# EAGLE design REF-BLE-MINI (EAGLE 7.7.0)

## Sheet 1 of 3
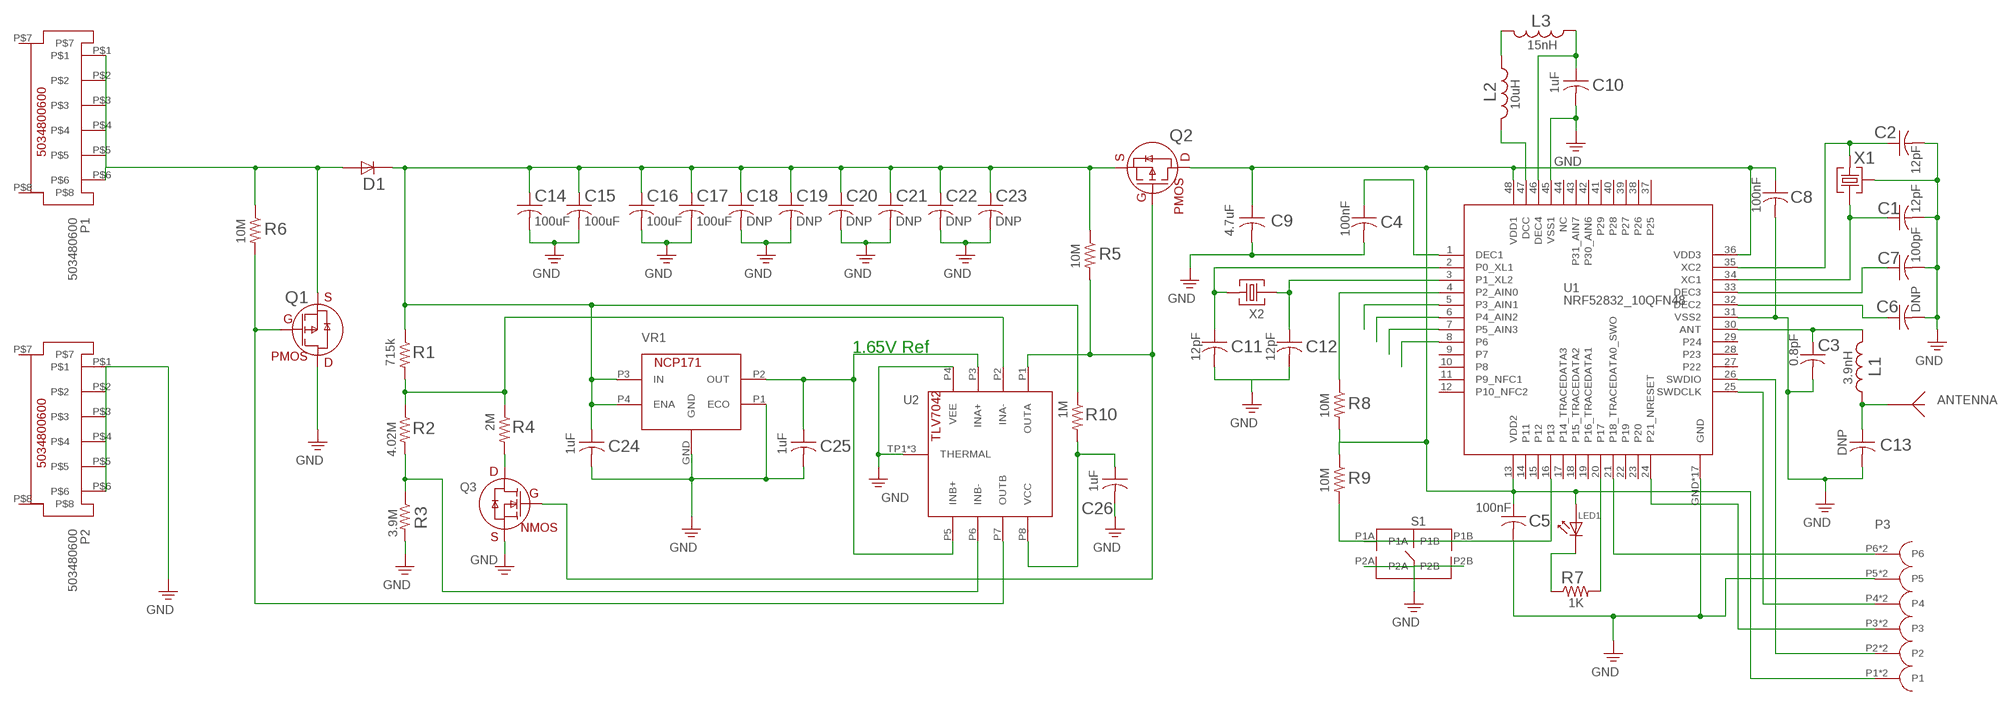
[diagram p0: schematic, sheet 1]

### Parts
ANTENNA  BLE-ANTENNA-NORDIC-2  [BLE-ANTENNA-NORDIC-2]
C1  12pF  C-USC0603  [C0603]
C2  12pF  C-USC0603  [C0603]
C3  0.8pF  C-USC0603  [C0603]
C4  100nF  C-USC0603  [C0603]
C5  100nF  C-USC0603  [C0603]
C6  DNP  C-USC0603  [C0603]
C7  100pF  C-USC0603  [C0603]
C8  100nF  C-USC0603  [C0603]
C9  4.7uF  C-USC0603  [C0603]
C10  1uF  C-USC0603  [C0603]
C11  12pF  C-USC0603  [C0603]
C12  12pF  C-USC0603  [C0603]
C13  DNP  C-USC0603  [C0603]
C14  100uF  C-USC1206  [C1206]
C15  100uF  C-USC1206  [C1206]
C16  100uF  C-USC1206  [C1206]
C17  100uF  C-USC1206  [C1206]
C18  DNP  C-USC1206  [C1206]
C19  DNP  C-USC1206  [C1206]
C20  DNP  C-USC1206  [C1206]
C21  DNP  C-USC1206  [C1206]
C22  DNP  C-USC1206  [C1206]
C23  DNP  C-USC1206  [C1206]
C24  1uF  C-USC0603  [C0603]
C25  1uF  C-USC0603  [C0603]
C26  1uF  C-USC0603  [C0603]
D1  BAT43WS-E3-08  [SOD-323-VISHAY]
L1  3.9nH  L0603  [L0603]
L2  10uH  L0603  [L0603]
L3  15nH  L0603  [L0603]
LED1  LTST-20KGKT  [TST-20KGKT]
P1  503480600  [5034800600]
P2  503480600  [5034800600]
P3  EC-06-CTX  [EC-06-CTX]
Q1  DMG2305U-13  [SOT-23-3-DIODESINC]
Q2  DMG2305U-13  [SOT-23-3-DIODESINC]
Q3  NX138AKR  [SOT-23-3-RENESAS]
R1  715k  R-US_R0603  [R0603]
R2  4.02M  R-US_R0603  [R0603]
R3  3.9M  R-US_R0603  [R0603]
R4  2M  R-US_R0603  [R0603]
R5  10M  R-US_R0603  [R0603]
R6  10M  R-US_R0603  [R0603]
R7  1K  R-US_R0603  [R0603]
R8  10M  R-US_R0603  [R0603]
R9  10M  R-US_R0603  [R0603]
R10  1M  R-US_R0603  [R0603]
S1  EVQ-P7A01P  [EVQ-P7A01P]
U1  NRF52832_10QFN48  [NRF52832_10]
U2  TLV7042DSG  [TLV7042DSG]
VR1  NCP171  [NCP171]
X1  FA-128-32MHZMF10Z-AJ5  [FA-128-EPSON]
X2  FC-135-32.7680KA-AC0  [FC-135-32.7680KA-AC0]

### Nets
GND: C1.2 C2.2 C3.2 C4.2 C5.2 C6.2 C7.2 C8.2 C9.2 C10.2 C11.2 C12.2 C13.2 C14.2 C15.2 C16.2 C17.2 C18.2 C19.2 C20.2 C21.2 C22.2 C23.2 C24.2 C25.2 P2.P$1 P2.P$2 P2.P$3 P2.P$4 P2.P$5 P2.P$6 P3.P5 P3.P11(P5) Q1.3(D) Q3.2(S) R3.2 S1.P2A S1.P2B U1.31(VSS2) U1.45(VSS1) U1.GND U1.P$2(GND) U1.P$3(GND) U1.P$4(GND) U1.P$5(GND) U1.P$6(GND) U1.P$7(GND) U1.P$8(GND) U1.P$9(GND) U1.P$10(GND) U1.P$11(GND) U1.P$12(GND) U1.P$13(GND) U1.P$14(GND) U1.P$15(GND) U1.P$16(GND) U1.P$17(GND) U2.P4(VEE) U2.TP1(THERMAL) U2.TP2(THERMAL) U2.TP3(THERMAL) VR1.GND VR1.P1(ECO) X1.P2(P3) X1.P4(P3)
N$1: L2.2 U1.47(DCC)
N$2: L2.1 L3.2
N$3: C10.1 L3.1 U1.46(DEC4)
N$4: C12.1 U1.3(P1_XL2) X2.P$1
N$5: C4.1 U1.1(DEC1)
N$6: C2.1 U1.35(XC2) X1.P1
N$7: C1.1 U1.34(XC1) X1.P3
N$8: C3.1 L1.2 U1.30(ANT)
N$9: ANTENNA.P$1 ANTENNA.P$2 C13.1 L1.1
N$10: C7.1 U1.33(DEC3)
N$11: C6.1 U1.32(DEC2)
N$12: D1.P2 P1.P$1 P1.P$2 P1.P$3 P1.P$4 P1.P$5 P1.P$6 Q1.2(S) R6.1
N$13: C11.1 U1.2(P0_XL1) X2.P$2
N$14: C14.1 C15.1 C16.1 C17.1 C18.1 C19.1 C20.1 C21.1 C22.1 C23.1 C24.1 D1.P1 Q2.2(S) R1.1 R5.1 R10.1 VR1.P3(IN) VR1.P4(ENA)
N$15: R1.2 R2.1 R4.1 U2.P2(INA-)
N$16: Q2.1(G) Q3.1(G) R5.2 U2.P1(OUTA)
N$17: LED1.C R7.1
N$18: R2.2 R3.1 U2.P6(INB-)
N$19: R7.2 U1.20(P17)
N$20: C25.1 U2.P3(INA+) U2.P5(INB+) VR1.P2(OUT)
N$21: P3.P4 P3.P10(P4) U1.25(SWDCLK)
N$22: P3.P3 P3.P9(P3) U1.24(P21_NRESET)
N$23: Q1.1(G) R6.2 U2.P7(OUTB)
N$24: R9.2 S1.P1A S1.P1B U1.16(P13)
N$25: P3.P6 P3.P12(P6) U1.21(P18_TRACEDATA0_SWO)
N$26: U1.5(P3_AIN1)
N$27: P3.P2 P3.P8(P2) U1.26(SWDIO)
N$28: R8.1 U1.4(P2_AIN0)
N$29: C5.1 C8.1 C9.1 LED1.A P3.P1 P3.P7(P1) Q2.3(D) R8.2 R9.1 U1.13(VDD2) U1.36(VDD3) U1.48(VDD1)
N$30: U1.6(P4_AIN2)
N$31: U1.7(P5_AIN3)
N$32: Q3.3(D) R4.2
N$33: U1.8(P6)
N$34: C26.1 R10.2 U2.P8(VCC)
PE: C26.2 ; supply symbol labelled GND
Unconnected: P1.P$7 P1.P$8 P2.P$7 P2.P$8 U1.9(P7) U1.10(P8) U1.11(P9_NFC1) U1.12(P10_NFC2) U1.14(P11) U1.15(P12) U1.17(P14_TRACEDATA3) U1.18(P15_TRACEDATA2) U1.19(P16_TRACEDATA1) U1.22(P19) U1.23(P20) U1.27(P22) U1.28(P23) U1.29(P24) U1.37(P25) U1.38(P26) U1.39(P27) U1.40(P28) U1.41(P29) U1.42(P30_AIN6) U1.43(P31_AIN7) U1.44(NC)

### Notes on the sheet
- 1.65V Ref

## Sheet 2 of 3

## Sheet 3 of 3

## Library data of the parts
ANTENNA = 00_PF_Nordic:BLE-ANTENNA-NORDIC-2
C1-C26 = resistor:C-US: CAPACITOR, American symbol
D1 = 00_PF_Nordic:BAT43WS-E3-08
L1-L3 = 00_PF_Nordic:L0603
LED1 = 00_PF_Nordic:LTST-20KGKT
P1 P2 = 00_PF_SMT:503480600
P3 = 00_PF_Nordic:EC-06-CTX
Q1 Q2 = 00_PF_Nordic:DMG2305U-13
Q3 = 00_PF_Nordic:NX138AKR
R1-R10 = resistor:R-US_: RESISTOR, American symbol
S1 = 00_PF_Nordic:EVQ-P7A01P
U1 = 00_PF_Nordic:NRF52832_10QFN48
U2 = 00_PF_Nordic:TLV7042DSG
VR1 = 00_PF_Nordic:NCP171
X1 = 00_PF_Nordic:FA-128-32MHZMF10Z-AJ5
X2 = 00_PF_Nordic:FC-135-32.7680KA-AC0

## Board
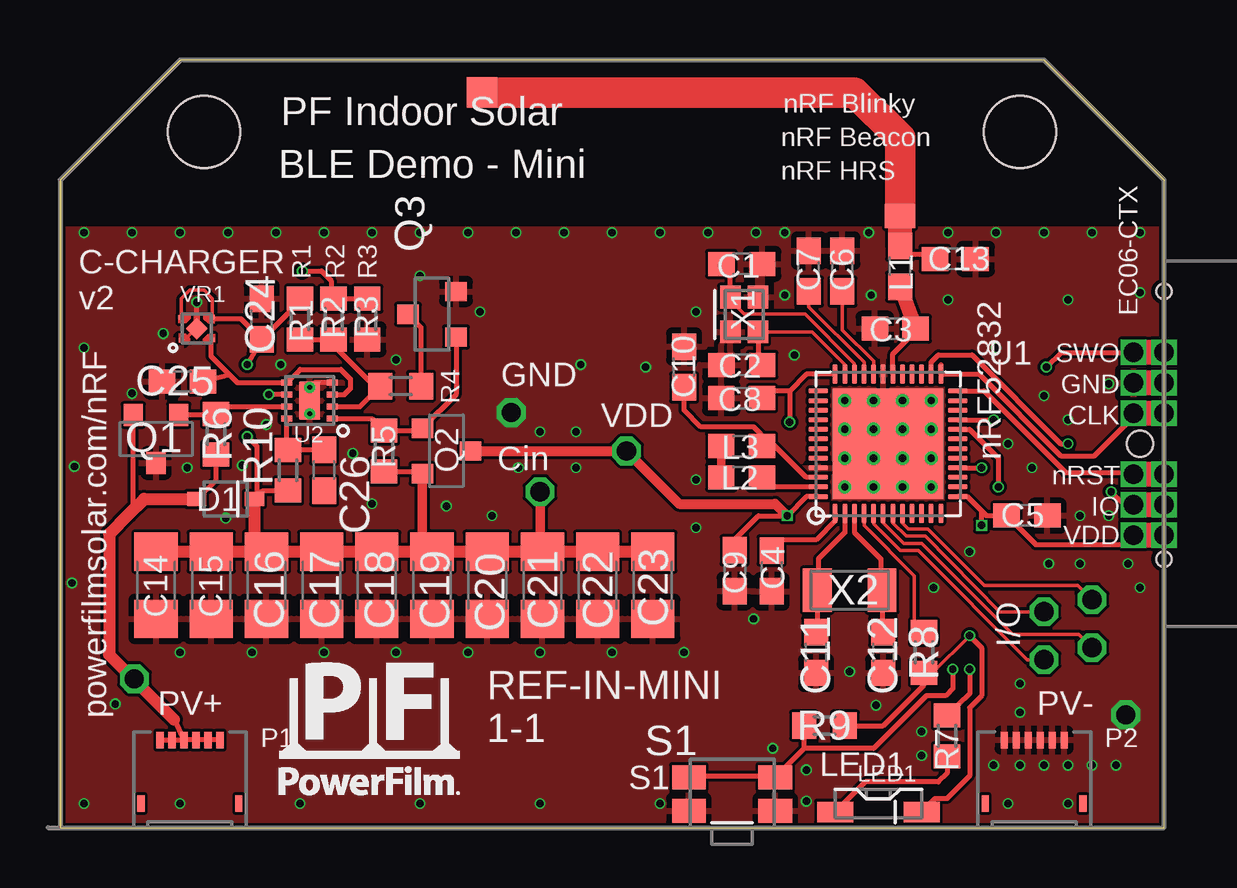
[diagram p1: board, top side]
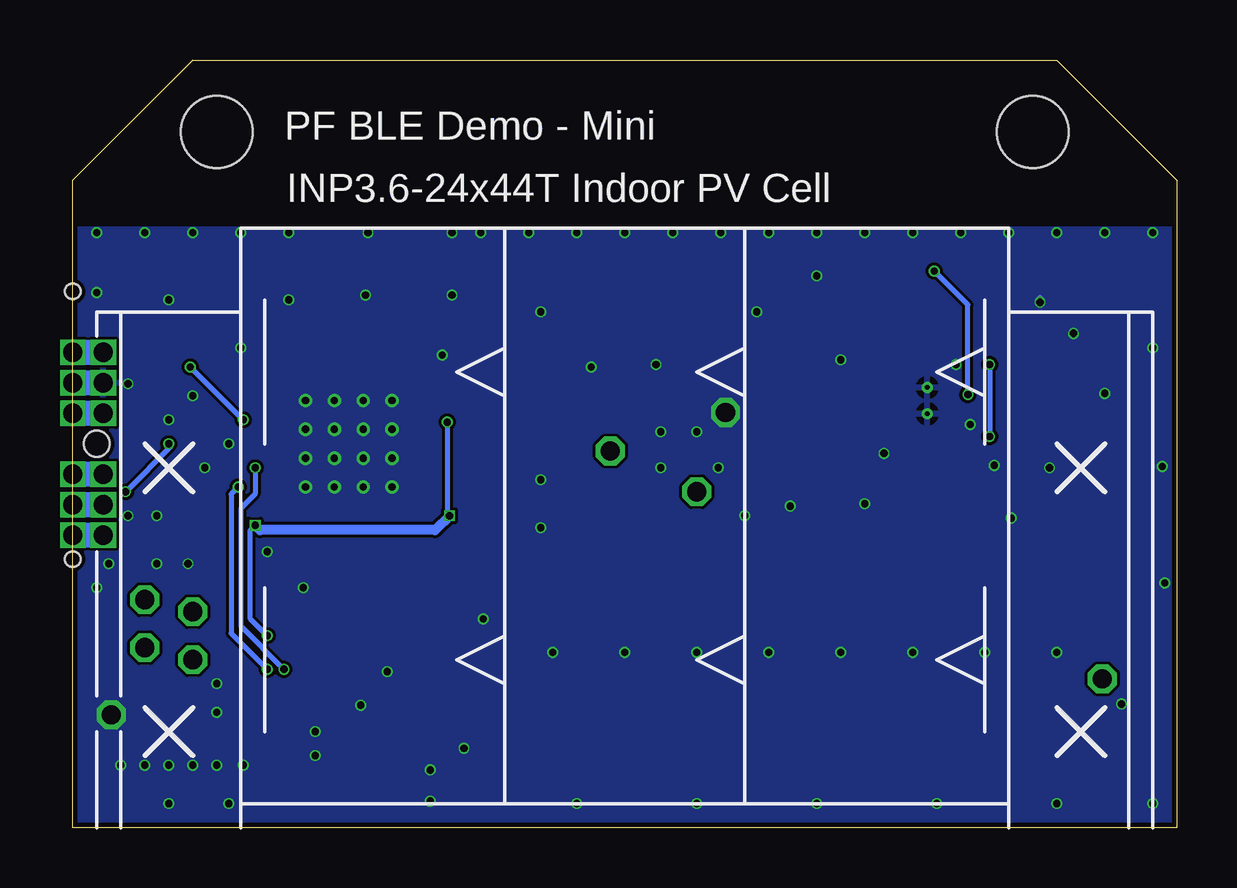
[diagram p2: board, bottom side, seen from below]

Size 46 x 32 mm. Coordinates in mm from the lower left corner, seen from the top.
Outline: 46,0 46,27 41,32 5,32 0,27 0,0 46,0
Copper layers (1+16): Top 0.035559375mm / dielectric 1.6mm / Bottom 0.035559375mm
Design rules "jlcpcb2layer *": minimum track width 5mil, minimum drill 0.2mm, track to track 5mil, track to pad 5mil, pad to pad 5mil, via to via 5mil, smd to smd 5mil, copper to edge 8mil, drill to drill 6mil, minimum pad ring 5mil, minimum via ring 3mil, stop-mask expansion 2.5mil, vias tented up to drill 0.3mm, thermal gap 10mil
Holes 3 mm at 6,29 40,29

### Footprints (pad centres in the part's own frame; a part is rotated, then mirrored left to right if it is on the bottom)
BLE-ANTENNA-NORDIC-2 = smd 1.27 x 1: P$1 0,0.5 | smd 1.27 x 1.27: P$2 -17.414,5.638
C0603 = smd 1.1 x 1: 1 -0.85,0; 2 0.85,0
C1206 = smd 1.6 x 1.8: 1 -1.4,0; 2 1.4,0
SOD-323-VISHAY = smd 0.8 x 0.6: P1 -1.2,0; P2 1.2,0
L0603 = smd 1.1 x 1: 1 -0.85,0; 2 0.85,0
TST-20KGKT = smd 1.5 x 0.85: A -1.8,0.35; C 1.8,0.35
5034800600 = smd 0.3 x 0.7: P$1 -1.25,1.65; P$2 -0.75,1.65; P$3 -0.25,1.65; P$4 0.25,1.65; P$5 0.75,1.65; P$6 1.25,1.65; P$7 -2.04,-1; P$8 2.04,-1
EC-06-CTX = drill 0.81 pad 1.02 square: P1 3.81,0; P2 2.54,0; P3 1.27,0; P4 -1.27,0; P5 -2.54,0; P6 -3.81,0; P7 3.81,-1.27; P8 2.54,-1.27; P9 1.27,-1.27; P10 -1.27,-1.27; P11 -2.54,-1.27; P12 -3.81,-1.27 | hole 0.64: -6.35,0; 4.81,0 | hole 1.07: 0,-1
SOT-23-3-DIODESINC = smd 0.8 x 0.9: 1 -0.95,-1; 2 0.95,-1; 3 0,1
SOT-23-3-RENESAS = smd 0.8 x 0.9: 1 -0.95,-1; 2 0.95,-1; 3 0,1
R0603 = smd 1 x 1.1: 1 -0.85,0; 2 0.85,0
EVQ-P7A01P = smd 1.4 x 1: P1A -1.8,0.7; P1B 1.8,0.7; P2A -1.8,-0.7; P2B 1.8,-0.7
NRF52832_10 = smd 0.8 x 0.2: 1 -2.9,2.2; 2 -2.9,1.8; 3 -2.9,1.4; 4 -2.9,1; 5 -2.9,0.6; 6 -2.9,0.2; 7 -2.9,-0.2; 8 -2.9,-0.6; 9 -2.9,-1; 10 -2.9,-1.4; 11 -2.9,-1.8; 12 -2.9,-2.2; 25 2.9,-2.2; 26 2.9,-1.8; 27 2.9,-1.4; 28 2.9,-1; 29 2.9,-0.6; 30 2.9,-0.2; 31 2.9,0.2; 32 2.9,0.6; 33 2.9,1; 34 2.9,1.4; 35 2.9,1.8; 36 2.9,2.2 | smd 0.2 x 0.8: 13 -2.2,-2.9; 14 -1.8,-2.9; 15 -1.4,-2.9; 16 -1,-2.9; 17 -0.6,-2.9; 18 -0.2,-2.9; 19 0.2,-2.9; 20 0.6,-2.9; 21 1,-2.9; 22 1.4,-2.9; 23 1.8,-2.9; 24 2.2,-2.9; 37 2.2,2.9; 38 1.8,2.9; 39 1.4,2.9; 40 1,2.9; 41 0.6,2.9; 42 0.2,2.9; 43 -0.2,2.9; 44 -0.6,2.9; 45 -1,2.9; 46 -1.4,2.9; 47 -1.8,2.9; 48 -2.2,2.9 | smd 4.6 x 4.6: GND 0,0 | drill 0.3 pad 0.5: P$2 -0.6,-0.6; P$3 -1.8,-0.6; P$4 0.6,-0.6; P$5 1.8,-0.6; P$6 -1.8,-1.8; P$7 -0.6,-1.8; P$8 0.6,-1.8; P$9 1.8,-1.8; P$10 -1.8,0.6; P$11 -0.6,0.6; P$12 0.6,0.6; P$13 1.8,0.6; P$14 1.8,1.8; P$15 0.6,1.8; P$16 -0.6,1.8; P$17 -1.8,1.8
TLV7042DSG = smd 0.5 x 0.25: P1 -0.95,0.75; P2 -0.95,0.25; P3 -0.95,-0.25; P4 -0.95,-0.75; P5 0.95,-0.75; P6 0.95,-0.25; P7 0.95,0.25; P8 0.95,0.75 | smd 0.9 x 1.6: TP1 0,0 | drill 0.2 pad 0.4: TP2 0,-0.55; TP3 0,0.55
NCP171 = smd 0.63 x 0.63 rotated 45: GND 0,0 | smd 0.2 x 0.2: P1 -0.645,-0.47; P2 0.645,-0.47; P3 0.645,0.47; P4 -0.645,0.47
FA-128-EPSON = smd 0.95 x 0.85: P1 -0.725,-0.575; P2 0.725,-0.575; P3 0.725,0.575; P4 -0.725,0.575
FC-135-32.7680KA-AC0 = smd 1.2 x 1.8: P$1 -1.35,0; P$2 1.35,0

### Placement (x,y rotation side)
ANTENNA  35,25 0 top
C1  28.41,23.49 0 top
C2  28.41,19.29 180 top
C3  34.8,20.8 180 top
C4  29.65,10.7 270 top
C5  40.29,13.01 0 top
C6  32.6,23.2 90 top
C7  31.2,23.2 90 top
C8  28.4,17.9 180 top
C9  28.11,10.71 270 top
C10  26,19.2 90 top
C11  31.5,7.3 270 top
C12  34.3,7.3 270 top
C13  37.3,23.7 0 top
C14  4,10.1 270 top
C15  6.3,10.1 270 top
C16  8.6,10.1 270 top
C17  10.9,10.1 270 top
C18  13.2,10.1 270 top
C19  15.5,10.1 270 top
C20  17.8,10.1 270 top
C21  20.1,10.1 270 top
C22  22.4,10.1 270 top
C23  24.7,10.1 270 top
C24  8.4,21.2 90 top
C25  5.1,18.6 180 top
C26  11,14.9 270 top
D1  6.9,13.7 180 top
L1  35,23.4 270 top
L2  28.4,14.6 0 top
L3  28.4,15.9 180 top
LED1  34.1,1 180 top
P1  5.41,2 0 top
P2  40.59,2 0 top
P3  46,16 270 top
Q1  4,16.2 180 top
Q2  16.1,15.7 270 top
Q3  15.5,21.4 90 top
R1  10,21.2 270 top
R2  11.4,21.2 90 top
R3  12.8,21.2 270 top
R4  14.2,18.4 0 top
R5  13.5,15.7 90 top
R6  6.5,16.4 90 top
R7  36.96,3.82 90 top
R8  36,7.3 270 top
R9  31.85,4.25 180 top
R10  9.5,14.9 90 top
S1  28,1.4 0 top
U1  34.5,16 90 top
U2  10.4,17.8 180 top
VR1  5.7,20.8 0 top
X1  28.51,21.39 90 top
X2  32.9,9.9 180 top

### Tracks (layer width: path | path; a pad name or v marks a point on that pad's centre or on a via)
GND  (via drill 0.3, 0.8)
  Top 0.152: 5.3,20.45 5.65,20.8 VR1.GND
  Top 0.2: VR1.GND v5.7,21.9 | U2.P4 10.6,18.55 U2.TP2 | P3.P5 P3.P11
  Bottom 0.2: v5.7,21.9 5.7,22.1
  other vias: 7,24.8 9,24.8 1,20 3,18.1 15,24.8 13,24.8 11,24.8 45,22.3 5,24.8 1,24.8 0.5,10.2 3,24.8 8.6,16.8 0.6,15.05 23,24.8 25,24.8 30.2,24.8 29,24.8 27,24.8 21,24.8 17,24.8 19,24.8 30.6,19.7 37.9,11.5 43.7,18.5 9.2,19.3 33.7,24.8 45,24.8 43,24.8 41,24.8 39,24.8 37,24.8 17.5,21.5 14,19.5 4.3,20.6 5.3,15 7.6,15.1 16.1,13.4 13,13.5 5,7.3 8,7.3 14,7.3 11,7.3 17,7.3 2.3,5.15 18,13 19.1,15 20,16.5 21.5,16.5 21.5,15 26.5,14.5 26.5,12.5 30.2,22.2 33.8,22.2 26.5,21.5 24.4,19.2 28.9,8.7 32.9,6.5 36.4,10 41.2,11 40.5,15 39.5,16 41,18 42,17 42.5,13 42.5,11 44.5,11 43.7,13 38.9,2.6 45,10 40,2.6 31.1,2.4 35.9,3 40,6 40,4.8 35.9,4 41,2.6 42,2.6 43,2.6 44,2.6 20,7.3 23,7.3 26,7.3 5,1 10,1 15,1 20,1 25,1 31.1,1.1 42,1 39.5,1 37,22 42,22 39,20 21.7,19.3 1,1 15,23 12.2,15.6 18.8,17.3 44.4,4.7 29.7,3.3 34,5.1 6.9,12.9
  pour Bottom: 46,0 46,25 0,25 0.01,5.5 0,0
  pour Top: 46,0 46,25 0,25 0.01,5.5 0,0
N$1
  Top 0.2: U1.47 29.65,14.2 L2.2
N$2
  Top 0.35: L2.1 L3.2
N$3
  Top 0.2: U1.46 31.1,14.6 29.6,16.1 L3.1 29.2,15.95 29.2,16.4 28.9,16.7 26.7,16.7 26,17.4 C10.1
N$4
  Top 0.2: U1.3 33.1,12.3 34.2,11.2 34.2,10.45 X2.P$1 34.25,8.4 C12.1
N$5
  Top 0.2: U1.1 32.3,12.8 31.5,12 30.1,12 arc90 C4.1
N$6
  Top 0.152: U1.35 32.7,19.3 31.34,20.66 X1.P1 | 29.47,19.5 C2.1
  Top 0.2: 29.57,19.6 C2.1 29.09,19.46 X1.P1
N$7
  Top 0.152: U1.34 33.1,19.35 31.05,21.4 28.5,21.4 27.93,21.96 X1.P3
  Top 0.2: X1.P3 27.93,23.11 C1.1
N$8
  Top 0.2: U1.30 34.7,19.75 35.65,20.7 C3.1
  Top 0.61: C3.1 L1.2
N$9
  Top 0.2: L1.1 35.2,24.25 35,24.3 35.3,24.3 35.4,23.9 36.1,23.9 36.2,23.8 C13.1
  Top 1: 35,24.3 ANTENNA.P$1 35,26
N$10
  Top 0.152: U1.33 33.5,19.4 31.2,21.7 C7.1
N$11
  Top 0.152: U1.32 33.9,19.45 32.6,20.75 C6.1
N$12  (via drill 0.8)
  Top 0.2: P1.P$6 P1.P$5 P1.P$4 P1.P$3 | P1.P$1 P1.P$2 P1.P$3 | 4.75,4.5 P1.P$3 | 2.85,13.05 3.05,13.25 Q1.2 | D1.P2 6.5,14.5 R6.1
  Top 0.4: 2.05,7.2 2.1,7.2 v3.1,6.2
  Top 0.5: 4.75,4.5 2.05,7.2 2.05,12.25 2.85,13.05 3.5,13.7 D1.P2
N$13
  Top 0.2: U1.2 32.7,12.3 31.6,11.2 31.6,10.45 X2.P$2 31.55,8.3 C11.1
N$14  (via drill 0.3, 0.8)
  Top 0.152: VR1.P4 5.05,22.05 5.4,22.4 6,22.4 6.34,22.05 VR1.P3
  Top 0.2: C24.1 7.55,21.2 6.3,21.2 VR1.P3 | C24.1 10,21.95 R1.1 | C24.1 v7.8,19.3 | v7.8,16.3 8.2,15.9 8.2,13.8 | 13.35,15 R5.1 15,14.85 Q2.2 | 8.2,13.8 D1.P1 | 8.2,13.8 8.45,14.05 R10.1
  Top 0.4: v20,14 20,11.6 C21.1 | C19.1 15.1,11.9 Q2.2
  Top 0.5: C23.1 C22.1 C21.1 C20.1 C19.1 C18.1 C17.1 C16.1 | C16.1 C15.1 C14.1 | D1.P1 8.1,12.1 C16.1
  Bottom 0.2: v7.8,19.3 v7.8,16.3
N$15
  Top 0.2: R1.2 R2.1 11.4,20.1 13.1,18.4 R4.1 12.5,17.55 U2.P2
N$16
  Top 0.2: U2.P1 13,17.05 R5.2 15,16.55 Q2.1 16.5,18.05 Q3.1
N$17
  Top 0.2: R7.1 36.96,2.26 36.6,1.9 33.55,1.9 LED1.C
N$18  (via drill 0.3)
  Top 0.2: R2.2 11.35,22 11.3,22 11.35,22.05 R2.2 | R2.2 R3.1 | U2.P6 v8.7,18.05 | v10.1,23.2 10.9,23.2 11.3,22.8 11.3,22.15 R2.2
  Bottom 0.2: v8.7,18.05 8.7,21.8 v10.1,23.2
N$19  (via drill 0.3)
  Top 0.2: U1.20 37.9,16.6 39.1,15.4 v39.1,14.2 | v37.9,6.6 37.9,5.57 R7.2
  Bottom 0.2: v39.1,14.2 39.4,13.9 39.4,8.1 v37.9,6.6
N$20
  Top 0.2: C25.1 7.04,18.89 | 7.04,18.89 6.3,19.64 6.3,20.3 VR1.P2 | U2.P3 11.85,18.05 12.1,18.3 12.1,18.7 11.7,19.1 10,19.1 U2.P5 7.39,18.55 7.04,18.89
  Top 0.203: U2.P5 9.25,18.55
N$21
  Top 0.2: 36.7,19.3 U1.25 38.3,18.9 41.7,15.5 43.1,15.5 44.9,17.3 45.97,17.3 P3.P4
  Top 0.406: 44.9,17.3 44.73,17.3 P3.P10
N$22
  Top 0.2: U1.24 38.5,18.2 41.9,14.8 45.93,14.8 | 45.93,14.8 P3.P3 | 45.93,14.8 45.86,14.73 P3.P9
N$23
  Top 0.2: U2.P7 6.75,17.55 R6.2 6.45,17.2 Q1.1
N$24  (via drill 0.3)
  Top 0.2: 31,3.3 S1.P1B 30.35,2.1 30.4,2.15 26.25,2.15 S1.P1A | 31,3.3 R9.2 | U1.16 v38.4,15 | v37.2,6.6 37.2,5.8 36.9,5.5 36.1,5.5 33.9,3.3 31,3.3
  Bottom 0.2: v38.4,15 38.4,13.9 39,13.3 39,8.4 v37.2,6.6
N$25  (via drill 0.3)
  Top 0.2: U1.21 v38.9,17 | v41.1,19.2 41.71,19.81 P3.P12 P3.P6
  Bottom 0.2: v38.9,17 v41.1,19.2
N$26  (via drill 0.8)
  Top 0.152: U1.5 33.9,12.65 35,11.55 35.75,11.55 40.3,7 v41,7
N$27  (via drill 0.3)
  Top 0.2: U1.26 36.3,19.4 36.6,19.7 38,19.7 41.7,16 v42,16 | v43.8,14 44.34,13.46 P3.P8 P3.P2
  Bottom 0.2: v42,16 41.9,15.9 v43.8,14
N$28
  Top 0.152: U1.4 33.5,12.6 35.6,10.5 35.6,8.05 R8.1
N$29  (via drill 0.3, 0.8)
  Top 0.152: R8.2 36.35,6.45 v37.9,8
  Top 0.2: U1.36 31.1,18.9 30.4,18.2 | 30.4,18.2 29.55,18.2 C8.1 | 38.4,13.2 38.59,13.01 C5.1 | 38.4,13.2 37.8,13.8 U1.13 | 39.16,12.86 C5.1 | U1.48 31.1,13.8 v30.3,13 29.1,13 28.1,12 C9.1 | 30.4,18.2 v30.4,16.9 | v38.4,12.6 38.4,13.2 | C5.1 40.65,11.8 45.51,11.8 | 45.51,11.8 P3.P1 | v37.9,8 38.4,7.5 38.4,5.5 37.9,5 37.9,2.15 36.95,1.2 36.45,1.2 LED1.A | R9.1 34.3,4.25 36,5.95 R8.2 | 45.51,11.8 45.12,12.19 P3.P7
  Top 0.406: Q2.3 v23.6,15.7 25.8,13.5 29.8,13.5 v30.3,13
  Bottom 0.2: v30.4,16.9 30.4,13.1 v30.3,13 | 38.2,12.3 v38.4,12.6 38.6,12.4 38.6,8.7 v37.9,8
  Bottom 0.406: v30.3,13 30.9,12.4 38.2,12.4 v38.4,12.6
N$30  (via drill 0.8)
  Top 0.152: U1.6 34.3,12.7 35.15,11.85 35.9,11.85 39.7,8.05 42.45,8.05 v43,7.5
N$31  (via drill 0.8)
  Top 0.152: U1.7 34.7,12.7 35.25,12.15 36.05,12.15 39.15,9 v41,9
N$32
  Top 0.2: R4.2 15.05,20.85 Q3.3
N$33  (via drill 0.8)
  Top 0.152: U1.8 35.1,12.7 35.35,12.45 36.15,12.45 38.5,10.1 42.4,10.1 v43,9.5
N$34
  Top 0.2: U2.P8 9.45,15.8 R10.2 C26.1

### Text on the board
tPlace: nRF Blinky | PF Indoor Solar | nRF Beacon | BLE Demo - Mini | nRF HRS | EC06-CTX | R1 | R2 | R3 | C-CHARGER | v2 | nRF52832 | powerfilmsolar.com/nRF | SWO | R4 | GND | GND | CLK | VDD | Cin | nRST | IO | VDD | I/O | PV+ | PV- | REF-IN-MINI | 1-1 | S1 | LED1
bPlace: PF BLE Demo - Mini | INP3.6-24x44T Indoor PV Cell
tNames: U1